# EAGLE design Sensor (EAGLE 6.4)
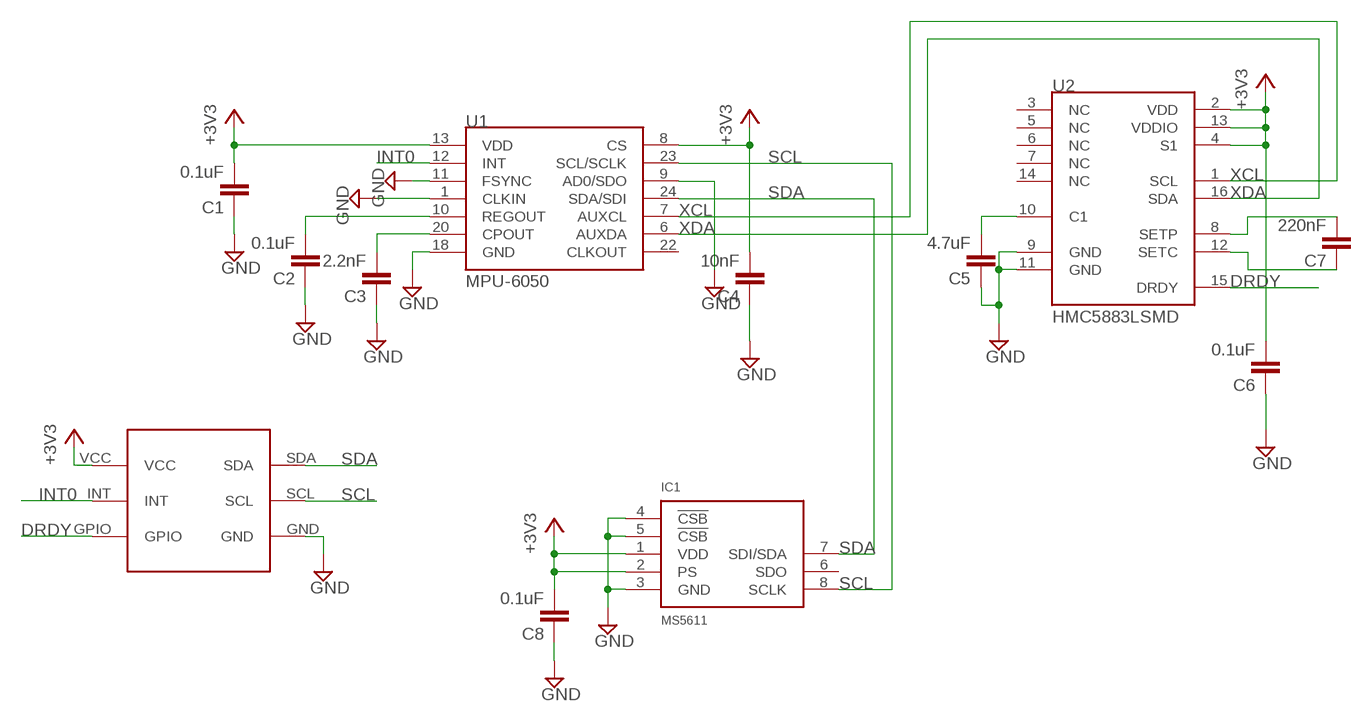
[diagram p0: schematic, sheet 1]

## Parts
C1  0.1uF  C-EUC0805  [C0805]
C2  0.1uF  C-EUC0805  [C0805]
C3  2.2nF  C-EUC0805  [C0805]
C4  10nF  C-EUC0805  [C0805]
C5  4.7uF  C-EUC0805  [C0805]
C6  0.1uF  C-EUC0805  [C0805]
C7  220nF  C-EUC0805  [C0805]
C8  0.1uF  C-EUC0805  [C0805]
IC1  MS5611  [QFN-MS5611]
U1  MPU-6050  MPU-6000QFN-24  [QFN-24-TESTING]
U2  HMC5883LSMD  [16LPCC]
U$1  SENSOR-BOARD  [SENSOR-BOARD]

## Nets
+3V3: C1.2 C4.2 C6.2 C8.2 IC1.1(VDD) IC1.2(PS) U1.8(CS) U1.13(VDD) U2.2(VDD) U2.4(S1) U2.13(VDDIO) U$1.VCC
DRDY: U2.15(DRDY) U$1.GPIO
GND: C1.1 C2.1 C3.1 C4.1 C5.1 C6.1 C8.1 IC1.3(GND) IC1.4(!CSB) IC1.5(!CSB) U1.1(CLKIN) U1.9(AD0/SDO) U1.11(FSYNC) U1.18(GND) U2.9(GND) U2.11(GND) U$1.GND
INT0: U1.12(INT) U$1.INT
N$3: C5.2 U2.10(C1)
N$6: C7.2 U2.8(SETP)
N$7: C7.1 U2.12(SETC)
N$18: C3.2 U1.20(CPOUT)
N$19: C2.2 U1.10(REGOUT)
SCL: IC1.8(SCLK) U1.23(SCL/SCLK) U$1.SCL
SDA: IC1.7(SDI/SDA) U1.24(SDA/SDI) U$1.SDA
XCL: U1.7(AUXCL) U2.1(SCL)
XDA: U1.6(AUXDA) U2.16(SDA)
Unconnected: IC1.6(SDO) U1.22(CLKOUT) U2.3(NC) U2.5(NC) U2.6(NC) U2.7(NC) U2.14(NC)

## Library data of the parts
C1-C8 = resistor:C-EU: CAPACITOR, European symbol
IC1 = aspirin:MS5611
U1 = SparkFun-Sensors:MPU-6000: MPU-6000 - I2C address is 0x68 with AD0 low and 0x69 with AD0 high.
U2 = SparkFun-Sensors:HMC5883L: 3 Axis Digital Compass IC
U$1 = Mini-Q:SENSOR-BOARD

## Board
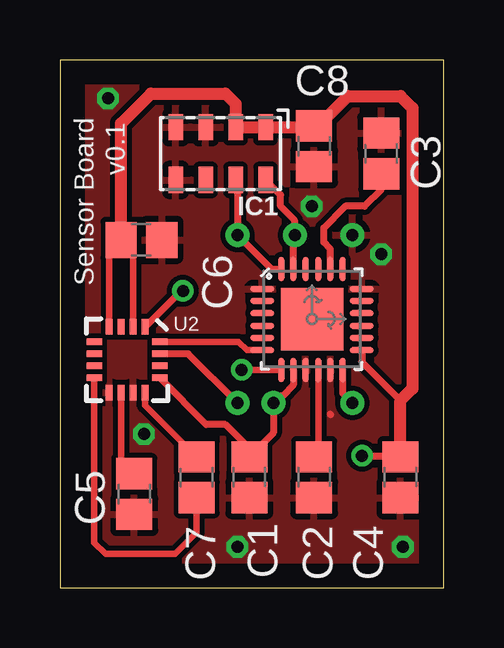
[diagram p1: board, top side]
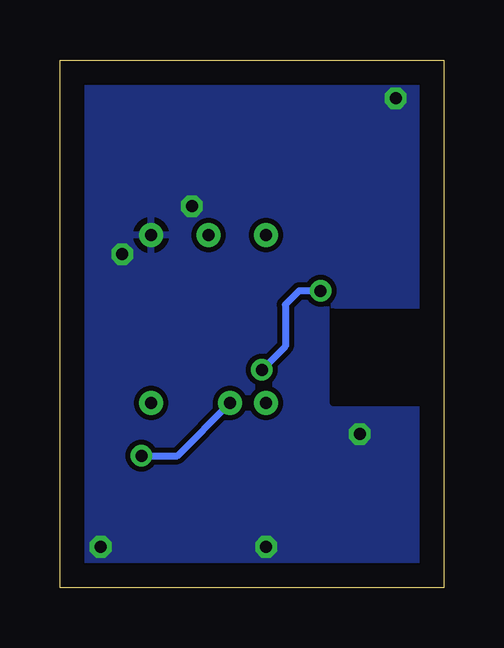
[diagram p2: board, bottom side, seen from below]

Size 16 x 22 mm. Coordinates in mm from the lower left corner, seen from the top.
Outline: 0,0 16,0 16,22 0,22 0,0
Copper layers (1*16): Top 0.035mm / dielectric 1.5mm / Bottom 0.035mm
Design rules "default": minimum track width 10mil, minimum drill 24mil, track to track 8mil, track to pad 8mil, pad to pad 8mil, via to via 8mil, smd to smd 8mil, copper to edge 40mil, drill to drill 8mil, minimum pad ring 10mil, minimum via ring 8mil, stop-mask expansion 4mil, vias tented up to drill 0mil, thermal gap 10mil

### Footprints (pad centres in the part's own frame; a part is rotated, then mirrored left to right if it is on the bottom)
C0805 = smd 1.3 x 1.5: 1 -0.85,0; 2 0.85,0
QFN-MS5611 = smd 1.1 x 0.6: 1 -1.1,1.875; 2 -1.1,0.625; 3 -1.1,-0.625; 4 -1.1,-1.875; 5 1.1,-1.875; 6 1.1,-0.625; 7 1.1,0.625; 8 1.1,1.875
QFN-24-TESTING = smd 1.016 x 0.254: 1 -2.066,1.257; 2 -2.066,0.75; 3 -2.066,0.247; 4 -2.066,-0.287; 5 -2.066,-0.792; 6 -2.066,-1.297; 13 2.086,-1.297; 14 2.086,-0.792; 15 2.086,-0.287; 16 2.086,0.247; 17 2.086,0.75; 18 2.086,1.257 | smd 0.254 x 1.016: 7 -1.267,-2.122; 8 -0.762,-2.122; 9 -0.258,-2.122; 10 0.278,-2.122; 11 0.78,-2.122; 12 1.287,-2.122; 19 1.287,2.082; 20 0.78,2.082; 21 0.278,2.082; 22 -0.258,2.082; 23 -0.762,2.082; 24 -1.267,2.082 | smd 2.616 x 2.616: P$1 0.02,-0.01
16LPCC = smd 0.65 x 0.28: 1 -1.37,0.75; 2 -1.37,0.25; 3 -1.37,-0.25; 4 -1.37,-0.75; 9 1.37,-0.75; 10 1.37,-0.25; 11 1.37,0.25; 12 1.37,0.75 | smd 0.28 x 0.65: 5 -0.75,-1.37; 6 -0.25,-1.37; 7 0.25,-1.37; 8 0.75,-1.37; 13 0.75,1.37; 14 0.25,1.37; 15 -0.25,1.37; 16 -0.75,1.37
SENSOR-BOARD = drill 0.5: GND 3.5,-2.4; GPIO -3.5,2.4; INT -3.5,-2.4; SCL 3.5,0; SDA 3.5,2.4; VCC -3.5,0.9

### Placement (x,y rotation side)
C1  7.9,4.6 90 top
C2  10.6,4.6 90 top
C3  13.4,18.1 270 top
C4  14.2,4.6 90 top
C5  3.1,3.9 90 top
C6  3.4,14.5 180 top
C7  5.7,4.6 270 top
C8  10.6,18.4 90 top
IC1  6.7,18.1 270 top
U1  10.5,11.2 0 top
U2  2.8,9.5 270 top
U$1  9.8,11.2 90 top

### Tracks (layer width: path | path; a pad name or v marks a point on that pad's centre or on a via)
+3V3  (via drill 0.5)
  Top 0.28: U2.4 2.05,14 C6.2 3.05,14 U2.2
  Top 0.3: 8,5.7 C1.2 | U2.13 4.17,8.73 6.1,6.8 6.9,6.8 7.9,5.8 C1.2 | U1.13 12.59,9.41 14.2,7.8 | 8.4,5.95 C1.2 | v12.6,5.5 14.15,5.5 C4.2 | C1.2 8.9,6.45 U$1.VCC 9.2,8 9.3,8 9.74,8.44 U1.8
  Top 0.5: C6.2 2.55,19.35 3.8,20.6 6.9,20.6 7.33,20.18 IC1.2 IC1.1 10.55,19.2 C8.2 10.75,19.25 12,20.5 14.2,20.5 14.7,20 14.7,8.3 14.2,7.8 C4.2
  Bottom 0.3: v12.6,5.5 11.1,5.5 U$1.VCC
DRDY
  Top 0.3: U$1.GPIO 5.35,9.75 U2.15
GND  (via drill 0.5)
  Top 0.3: 11.28,7.22 11.3,7.2
  other vias: 2,20.4 3.5,6.4 10.5,15.9 13.4,13.9 14.3,1.7 7.4,1.7
  pour Top: 0,22 16,22 16,0 0,0
  pour Bottom (rank 2): 0,22 0,0 16,0 16,22
INT0
  Top 0.3: U1.12 11.79,8.11 U$1.INT
N$1
  cutout Bottom: 0.9,11.5 0.9,7.7 4.6,7.7 4.6,11.5
N$3
  Top 0.28: U2.10 2.55,5.3 C5.2
N$6
  Top 0.28: C7.2 5.7,2.3 4.8,1.4 1.9,1.4 1.43,1.87 U2.8
N$7
  Top 0.28: U2.12 3.55,7.6 C7.1
N$18
  Top 0.3: U1.20 11.28,14.12 11,14.4 11,15 11.9,15.9 12.7,15.9 13.4,16.6 C3.2
N$19
  Top 0.28: 10.78,5.67 U1.10
  Top 0.3: 10.78,5.67 C2.2
SCL
  Top 0.3: U1.23 9.74,14.64 U$1.SCL 9.8,15.3 9.2,15.9 9.2,16.38 IC1.8
SDA
  Top 0.3: IC1.7 7.4,16.93 U$1.SDA 8.82,13.28 U1.24
XCL  (via drill 0.5)
  Top 0.28: U1.7 v7.58,9.08
  Top 0.3: v5.13,12.37 5.05,12.37 U2.1
  Bottom 0.3: v7.58,9.08 6.6,10.06 6.6,11.8 6.03,12.37 v5.13,12.37
XDA
  Top 0.28: U2.16 7.45,10.25 7.8,9.9 U1.6

### Text on the board
tNames: v0.1 | Sensor Board